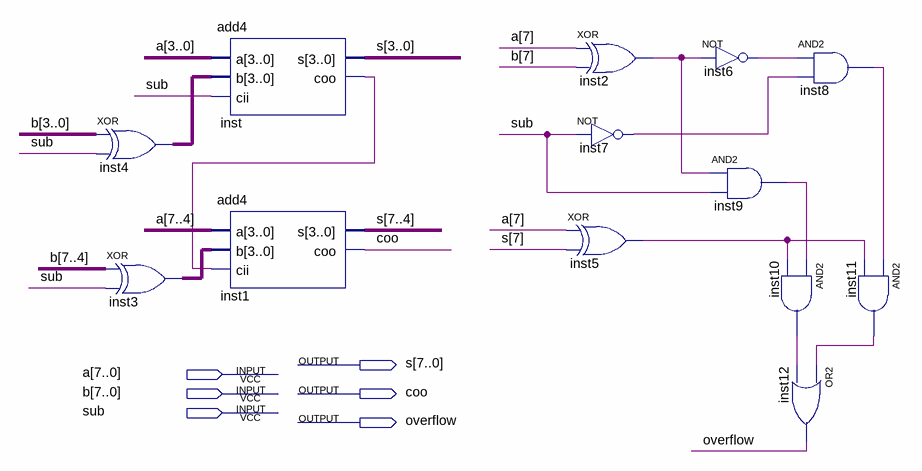
[diagram p0: schematic sheet]
// Quartus schematic addsub.bdf as structural Verilog: 13 symbols, 6 pins
module addsub (
  input  [7:0] a,
  input  [7:0] b,
  input  sub,
  output [7:0] s,
  output coo,
  output overflow
);

  wire inst2_out, inst5_out, inst6_out, inst7_out, inst8_out, inst9_out, inst10_out, inst11_out, inst_coo;
  wire [3:0] inst3_out, inst4_out;

  assign inst4_out = b[3:0] ^ {4{sub}};  // XOR inst4, 4 bits wide
  assign inst3_out = b[7:4] ^ {4{sub}};  // XOR inst3, 4 bits wide
  add4 inst (.a(a[3:0]), .b(inst4_out), .cii(sub), .s(s[3:0]), .coo(inst_coo));
  add4 inst1 (.a(a[7:4]), .b(inst3_out), .cii(inst_coo), .s(s[7:4]), .coo(coo));
  xor inst2 (inst2_out, a[7], b[7]);
  not inst7 (inst7_out, sub);
  xor inst5 (inst5_out, a[7], s[7]);
  not inst6 (inst6_out, inst2_out);
  and inst9 (inst9_out, inst2_out, sub);
  and inst10 (inst10_out, inst9_out, inst5_out);
  or inst12 (overflow, inst11_out, inst10_out);
  and inst8 (inst8_out, inst6_out, inst7_out);
  and inst11 (inst11_out, inst8_out, inst5_out);
endmodule
